# EAGLE design Becky-Stern-20mm-Switched-Battery-v1 (EAGLE 9.7.0)
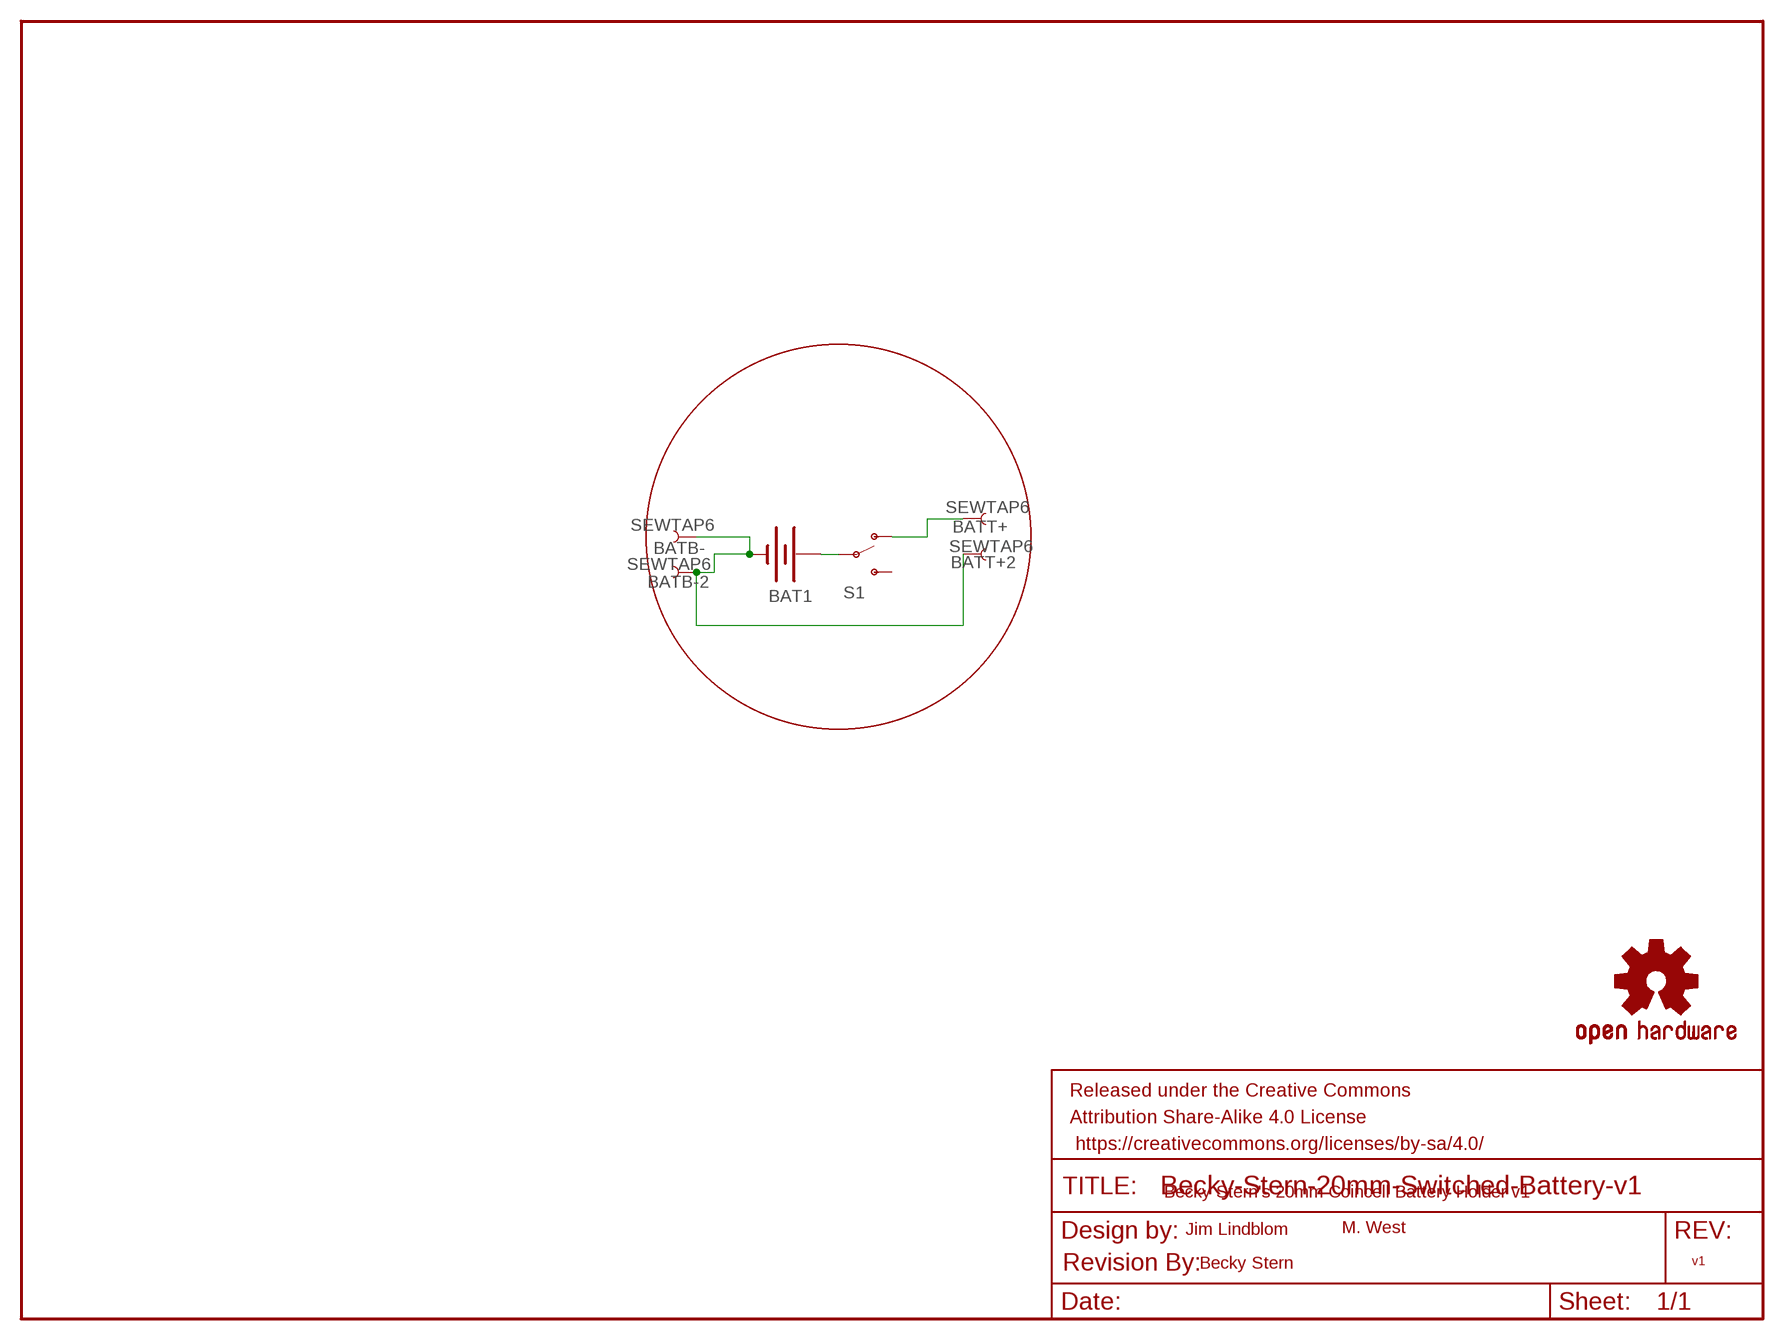
[diagram p0: schematic, sheet 1]

## Parts
BAT1  20mm coincell  BATTERY-20MM_SMD_4LEGS  [BATTCON_20MM_4LEGS]
BATB-  SEWTAP6  [PETAL-SMALL-2SIDE]
BATB-2  SEWTAP6  [PETAL-SMALL-2SIDE]
BATT+  SEWTAP6  [PETAL-SMALL-2SIDE]
BATT+2  SEWTAP6  [PETAL-SMALL-2SIDE]
FRAME1  FRAME-LETTER  [CREATIVE_COMMONS]
LOGO2  OSHW-LOGOS  [OSHW-LOGO-S]
S1  SWITCH-SPDT-SMD-AYZ0202  [AYZ0202]
U$1  REVISION  [REVISION]

## Nets
GND: BAT1.NEGATIVE(-) BATB-2.1 BATB-.1 BATT+2.1
N$1: BAT1.POSITIVE@1(+) BAT1.POSITIVE@2(+) BAT1.POSITIVE@3(+) BAT1.POSITIVE@4(+) S1.2(P)
N$2: BATT+.1 S1.1(O)
Unconnected: S1.3(S)

## Notes on the sheet
- Becky Stern's 20mm Coincell Battery Holder v1
- Jim Lindblom | M. West
- v1
- Becky Stern

## Library data of the parts
BAT1 = 20mm battery holder:BATTERY: Battery - Single Cell A variety of battery chemistries, sizes, and footprints. Device List: 20MM_PTH - Coin Cell Battery Holder - 20mm (PTH) <https://www.sparkfun.com/products/783> 20MM_PTH_KIT- Coin Cell battery Holder - 20 mm (PTH) <http://www.sparkfun.com/products/783>kit version with special mask 6.8MM_PTH - Coin Cell Battery Holder - 6.8MM(SMD) <https://www.digikey.com/product-detail/en/seiko-instruments/MS621FE-FL11E/728-1057-ND/1889208?WT.srch=1&gclid=CNOQ5a6LzdQCFZS2wAodXCkE0g> 12MM_SMD - Coin Cell Battery Holder - 12mm (SMD) <https://www.sparkfun.com/products/10592> 12MM_PTH - Coin Cell Battery Holder - 12mm (PTH) <https://www.sparkfun.com/products/7948> 20MM_SMD - 20mm Coin Cell Battery Holder (SMD) (2 legs) Used on the Big Time Watch Kit <https://www.sparkfun.com/products/11734> 20MM_SMD_4LEGS - Coin Cell Battery Holder - 20mm (SMD) <https://www.sparkfun.com/products/11892> 20MM_SMD_4LEGS_OVERPASTE - Coin Cell Battery Holder - 20mm (SMD) <https://www.sparkfun.com/products/11892> (Over-paste on the legs) 24.5MM_PTH - Coin Cell Battery Holder - 24.5mm (PTH) <https://www.sparkfun.com/products/8863> 9V - 9V Battery Holder - PC Mount Used on the SparkFun SparkPunk Sound Kit <https://www.sparkfun.com/products/11177> and SparkFun SparkPunk Sequencer Kit <https://www.sparkfun.com/products/12707> 18650 - Battery Holder - 18650 (PTH) <https://www.sparkfun.com/products/13113> AA - Battery Holder - 1xAA (PTH) <https://www.sparkfun.com/products/7949> AAA - Battery Holder - 1xAAA (PTH) <https://www.sparkfun.com/products/12718> AA_KIT - Battery Holder - 1xAA (PTH) <https://www.sparkfun.com/products/7949> Special kit package - pads only have exposed copper on one side of the board. AAA_KIT - Battery Holder - 1xAAA (PTH) <https://www.sparkfun.com/products/12718> Special kit package - pads only have exposed copper on one side of the board.; PROD_ID: BATT-10373; SF_SKU: PRT-11892
BATB- BATB-2 BATT+ BATT+2 = LilyPad-Wearables:SEWTAP: Sew Taps for LilyPad Boards.
FRAME1 = SparkFun-Aesthetics:FRAME-LETTER: Schematic Frame - Letter Standard 8.5x11 US Letter frame
LOGO2 = SparkFun-Aesthetics:OSHW-LOGO: Open-Source Hardware (OSHW) Logo This logo indicates the piece of hardware it is found on incorporates a OSHW license and/or adheres to the definition of open source hardware found here: http://freedomdefined.org/OSHW
S1 = 20mm battery holder:SWITCH-SPDT: Single Pole, Double Throw (SPDT) Switch Single-pole, double-throw (SPDT) switch. Variant Overview SMD-AYZ0202 Surface Mount DPDT Switch <https://www.sparkfun.com/products/597> (COM-00597) Used on e.g. LilyPad Arduino USB - ATmega32U4 Board <https://www.sparkfun.com/products/12049> PTH-11.6X4.0MM SPDT Mini Power Switch <https://www.sparkfun.com/products/102> (COM-00102) Used on e.g. SparkFun Simon Says - Through-Hole Soldering Kit <https://www.sparkfun.com/products/10547> (KIT-10547) PTH-11.6X4.0MM-KIT KIT version of SPDT Mini Power Switch - Simplifies soldering by removing tStop of switch pins - only one side can be soldered. PTH-11.6X4.0MM-LOCK LOCK version of SPDT Mini Power Switch - Offset pins hold switch in place for easier soldering. SMD-RIGHT-ANGLE Surface Mount Right Angle Switch <https://www.sparkfun.com/products/10860> (COM-10860) Used on e.g. SparkFun ESP8266 Thing <https://www.sparkfun.com/products/13231>; PROD_ID: SWCH-08179; SF_ID: COM-00597
U$1 = SparkFun-Aesthetics:REVISION: "Revision By" Text Preceding text for revisor documentation. Includes schematic text on "symbols" layer, and board text on tDoc.

## Net classes
1 VCC: width 0.203 mm

## Board
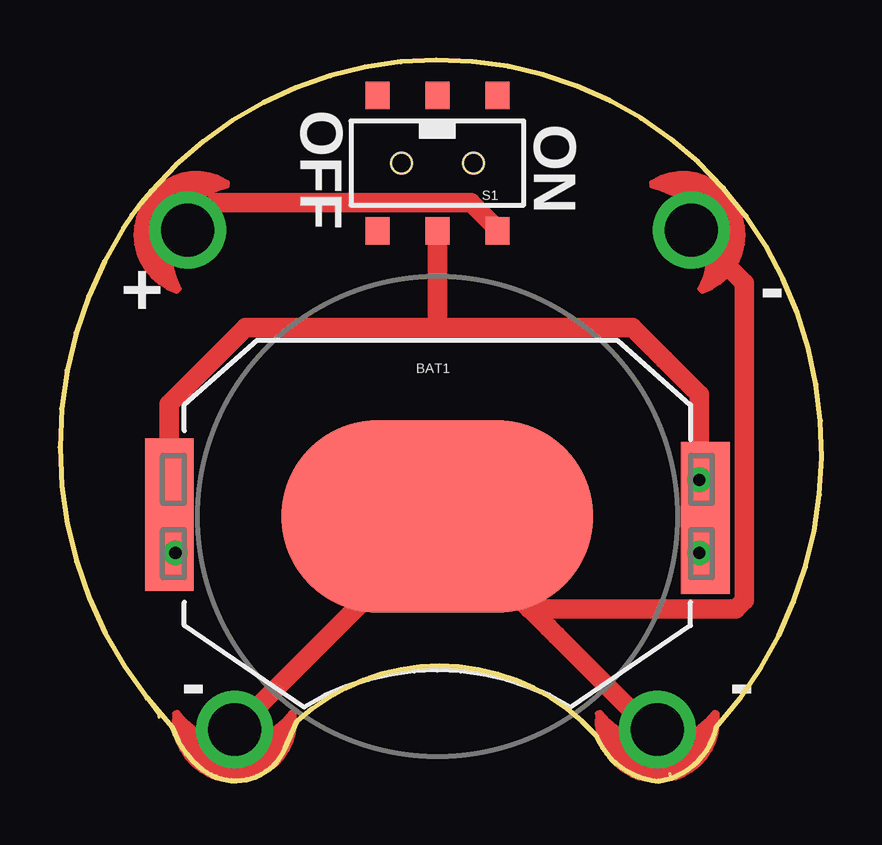
[diagram p1: board, top side]
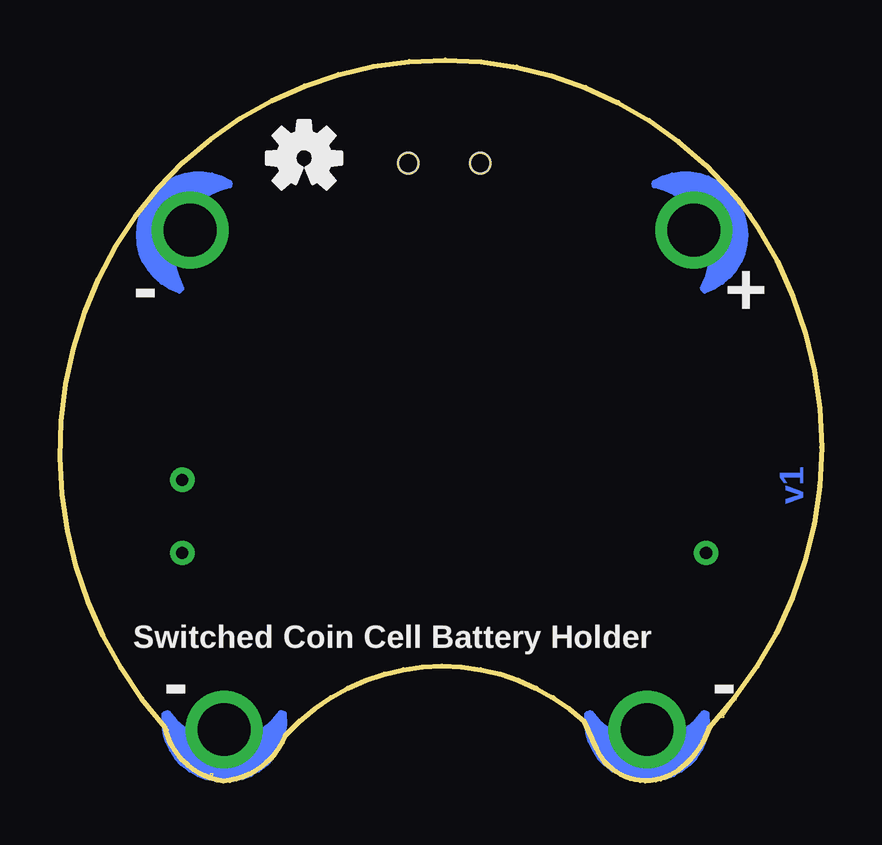
[diagram p2: board, bottom side, seen from below]

Size 31.75 x 30.07 mm. Coordinates in mm from the lower left corner, seen from the top.
Outline: 5.96,0.48 arc103 9.39,1.37
Outline: 5.99,0.52 arc180 5.93,0.44
Outline: 9.43,1.35 arc180 9.34,1.39 arc-180 9.43,1.35
Outline: 24.95,0.01 arc-63 22.37,1.88 arc63 24.95,0.01
Outline: 9.43,1.35 arc-180 9.34,1.39 arc180 9.43,1.35
Outline: 9.89,2.51 arc-90 22.34,1.93 arc90 9.89,2.51
Outline: 29.43,22.32 arc108 3.8,24.61
Outline: 3.76,24.64 arc180 3.84,24.57
Outline: 24.95,0.01 arc70 27.37,2.26
Outline: 27.37,2.26 arc72 29.43,22.32
Outline: 3.8,24.61 arc9 2.65,23.08
Outline: 3.84,24.57 arc180 3.76,24.64
Outline: 2.61,23.11 arc180 2.7,23.06
Outline: 2.65,23.08 arc76 4.69,2.26
Outline: 2.7,23.06 arc180 2.61,23.11
Outline: 4.69,2.26 arc35 5.96,0.48
Outline: 5.93,0.44 arc180 5.99,0.52
Outline: 5.96,0.48 arc103 9.39,1.37
Outline: 5.99,0.52 arc180 5.93,0.44
Outline: 25.44,0.24 arc180 25.42,0.34
Outline: 9.39,1.37 9.89,2.51
Outline: 29.43,22.32 arc108 3.8,24.61
Outline: 3.76,24.64 arc180 3.84,24.57
Outline: 24.95,0.01 arc70 27.37,2.26
Outline: 25.42,0.34 arc180 25.44,0.24
Outline: 27.37,2.26 arc72 29.43,22.32
Outline: 3.8,24.61 arc9 2.65,23.08
Outline: 3.84,24.57 arc180 3.76,24.64
Outline: 2.61,23.11 arc180 2.7,23.06
Outline: 2.65,23.08 arc76 4.69,2.26
Outline: 2.7,23.06 arc180 2.61,23.11
Outline: 4.69,2.26 arc35 5.96,0.48
Outline: 5.93,0.44 arc180 5.99,0.52
Outline: 3.62,3.4 4.13,2.69
Outline: 9.94,2.49 arc180 9.85,2.53 arc-180 9.94,2.49
Outline: 9.86,2.55 arc180 9.93,2.47 arc-180 9.86,2.55
Outline: 27.34,2.12 arc180 27.24,2.14 arc-180 27.34,2.12
Outline: 27.25,2.16 arc180 27.33,2.1 arc-180 27.25,2.16
Outline: 4.65,2.22 arc180 4.72,2.29 arc-180 4.65,2.22
Outline: 4.73,2.27 arc180 4.64,2.24 arc-180 4.73,2.27
Outline: 6.84,0 arc180 6.75,0.04 arc-180 6.84,0
Outline: 4.09,2.66 arc180 4.17,2.72 arc-180 4.09,2.66
Outline: 3.66,3.43 arc180 3.58,3.37 arc-180 3.66,3.43
Outline: 4.18,2.7 arc180 4.08,2.67 arc-180 4.18,2.7
Outline: circle at 14.24,25.75 radius 0.42
Outline: circle at 17.24,25.75 radius 0.42
Outline: circle at 14.24,25.75 radius 0.42
Outline: circle at 17.24,25.75 radius 0.42
Copper layers (1*16): Top / Bottom
Stack-up Default Layer Stack: Top User Defined 0.035mm / Dielectric-1 User Defined 1.5mm / Bottom User Defined 0.035mm
Design rules: minimum drill size 20mil, minimum copper width 10mil, minimum copper width class=1 8mil, keepout clearance 0mil, drill distance 8mil, via restrict clearance 0mil, dimension clearance 8mil, restrict clearance 0mil, copper clearance wire_polygon to wire_polygon 10mil, copper clearance wire_polygon to via 10mil, copper clearance pad_smd to via 10mil, copper clearance via to via 10mil, copper clearance wire_polygon to pad_smd 8mil, copper clearance pad_smd to pad_smd 8mil, copper clearance smd to pad (same net) 8mil, copper clearance smd to via (same net) 8mil, copper clearance smd to smd (same net) 8mil

### Footprints (pad centres in the part's own frame; a part is rotated, then mirrored left to right if it is on the bottom)
BATTCON_20MM_4LEGS = smd 13 x 8: NEGATIVE 0,0 | smd 2.032 x 3.175: POSITIVE@1 -11.176,1.651; POSITIVE@2 -11.176,-1.524; POSITIVE@3 11.176,1.524; POSITIVE@4 11.176,-1.651
PETAL-SMALL-2SIDE = drill 2.2: 1 0,0
AYZ0202 = smd 1 x 1.15: 1 -2.5,2.825; 2 0,2.825; 3 2.5,2.825; 4 -2.5,-2.825; 5 0,-2.825; 6 2.5,-2.825 | hole 0.85: 1.5,0; -1.5,0

### Placement (x,y rotation side)
BAT1  15.74,11.04 0 top
BATB-  7.28,2.15 0 top
BATB-2  24.9,2.15 0 top
BATT+  5.32,22.98 245 top
BATT+2  26.33,22.98 115 top
FRAME1  -9.23,-9.68 0 top  (outside the outline)
LOGO2  21.58,25.98 0 bottom
S1  15.74,25.78 180 top
U$1  2.16,-12.26 0 top  (outside the outline)

### Tracks (layer width: path | path; a pad name or v marks a point on that pad's centre or on a via)
GND
  Top 0.813: BATB-2.1 24.63,2.15 20.69,6.09 20.37,6.41 BAT1.NEGATIVE | BATT+2.1 28.54,20.77 28.54,7.55 28.18,7.2 19.58,7.2 BAT1.NEGATIVE | BAT1.NEGATIVE 15.74,10.61 BATB-.1
N$1  (via drill 0.51)
  Top 0.254: v26.66,12.57 BAT1.POSITIVE@3
  Top 0.813: 15.74,18.92 23.86,18.92 25.2,17.58 26.66,16.12 v26.66,12.57 v26.66,9.52 26.91,9.52 27.42,9.01 27.42,9.9 BAT1.POSITIVE@4 | BAT1.POSITIVE@2 v4.81,9.52 4.81,12.44 BAT1.POSITIVE@1 4.56,15.73 7.75,18.92 15.74,18.92 | 15.74,18.92 S1.2
N$2
  Top 0.813: S1.1 18.24,23.03 17.13,24.14 6.48,24.14 BATT+.1

### Text on the board
Bottom: v1
tPlace: OFF | ON | - | + | - | - | -
bPlace: - | + | Switched Coin Cell Battery Holder | - | - | -
Measures: All Units Inches
tDocu: M. West | Jim Lindblom | Becky Stern | Board Thickness: 0.8mm | Black Solder Mask